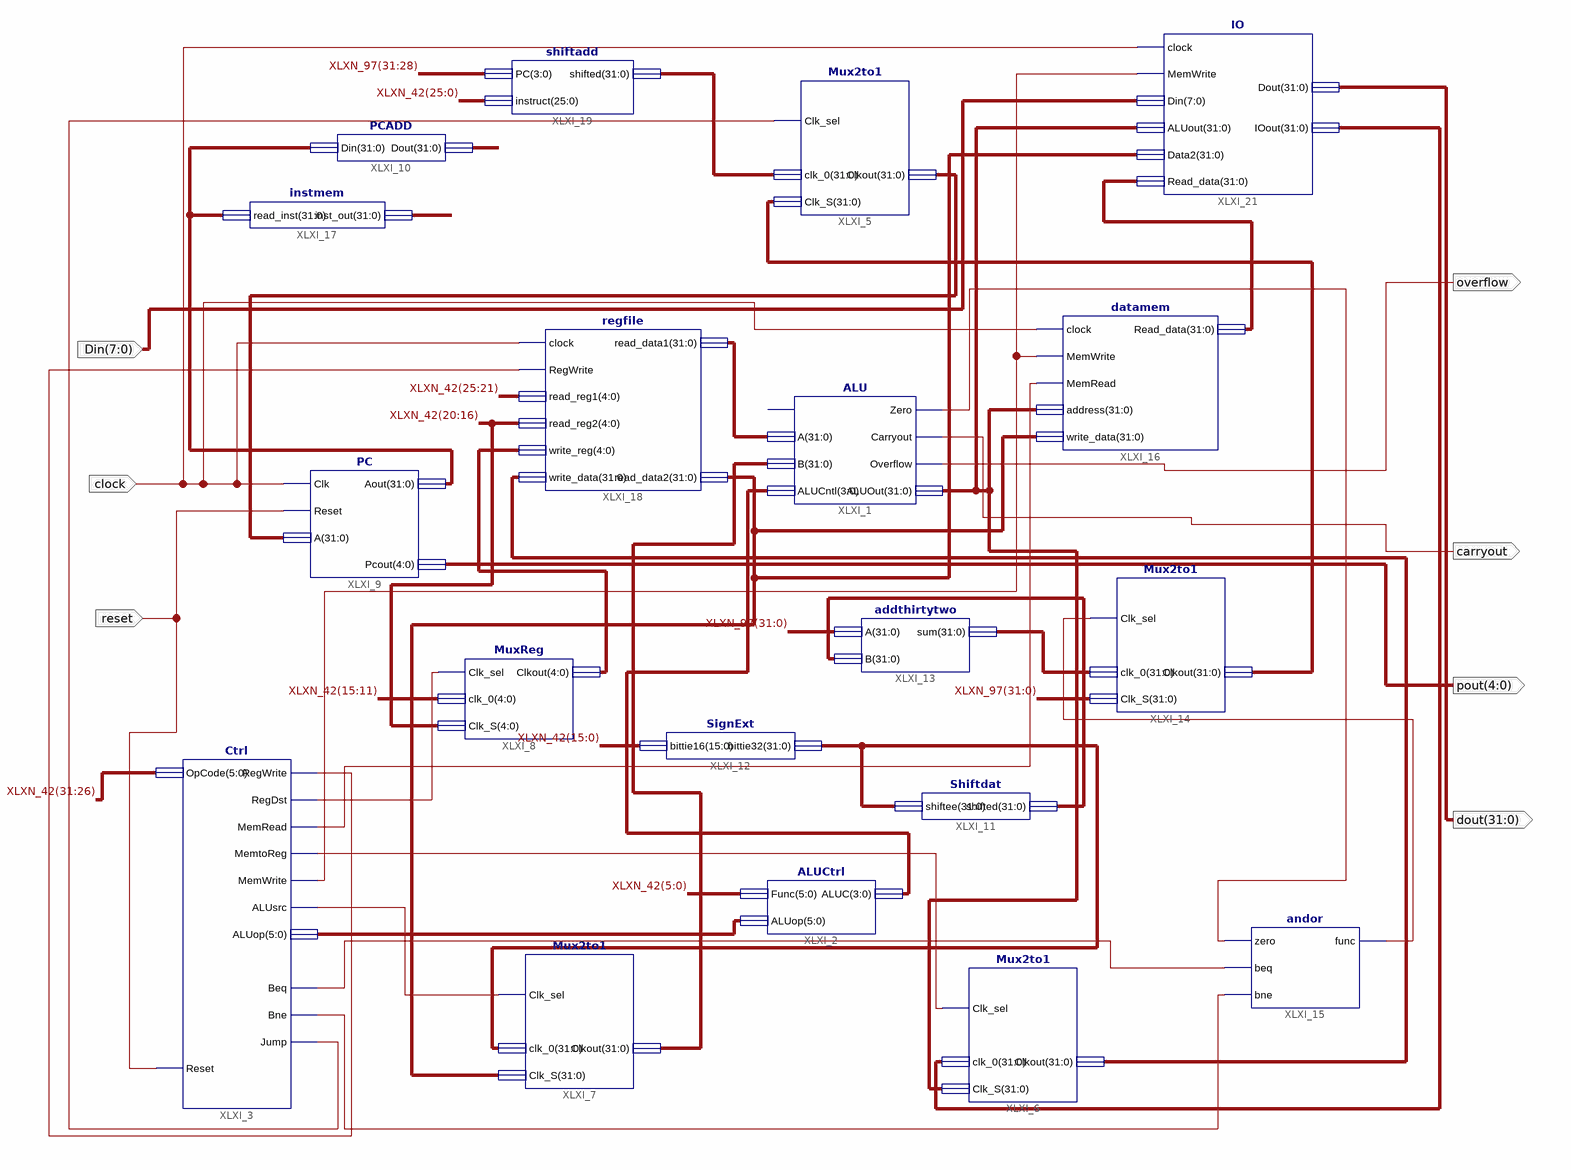
[diagram p0: schematic sheet 1]
// Xilinx ISE schematic datapath.sch (spartan3e) as structural Verilog: 19 symbols, 7 ports
module datapath (
  input  reset,
  input  clock,
  input  [7:0] Din,
  output overflow,
  output carryout,
  output [31:0] dout,
  output [4:0] pout
);

  wire func, XLXN_60, XLXN_61, XLXN_64, XLXN_85, XLXN_88, XLXN_91, XLXN_92, XLXN_118, XLXN_144, XLXN_148;
  wire [3:0] XLXN_123;
  wire [4:0] XLXN_103;
  wire [5:0] XLXN_87;
  wire [31:0] XLXN_42, XLXN_50, XLXN_52, XLXN_53, XLXN_66, XLXN_70, XLXN_71, XLXN_95, XLXN_96, XLXN_97,
       XLXN_100, XLXN_107, XLXN_114, XLXN_115, XLXN_125, XLXN_128;

  Mux2to1 XLXI_5 (.Clk_sel(XLXN_92), .clk_0(XLXN_53), .Clk_S(XLXN_95), .Clkout(XLXN_52));
  instmem XLXI_17 (.read_inst(XLXN_50), .inst_out(XLXN_42));
  PCADD XLXI_10 (.Din(XLXN_50), .Dout(XLXN_97));
  PC XLXI_9 (.Clk(clock), .Reset(reset), .A(XLXN_52), .Aout(XLXN_50), .Pcout(pout));
  shiftadd XLXI_19 (.PC(XLXN_97[31:28]), .instruct(XLXN_42[25:0]), .shifted(XLXN_53));
  regfile XLXI_18 (
    .clock(clock), .RegWrite(XLXN_60), .read_reg1(XLXN_42[25:21]), .read_reg2(XLXN_42[20:16]),
    .write_reg(XLXN_103), .write_data(XLXN_100), .read_data1(XLXN_114), .read_data2(XLXN_71));
  datamem XLXI_16 (
    .clock(clock), .MemWrite(XLXN_118), .MemRead(XLXN_64), .address(XLXN_125), .write_data(XLXN_71),
    .Read_data(XLXN_96));
  andor XLXI_15 (.zero(func), .beq(XLXN_88), .bne(XLXN_91), .func(XLXN_148));
  Mux2to1 XLXI_14 (.Clk_sel(XLXN_148), .clk_0(XLXN_107), .Clk_S(XLXN_97), .Clkout(XLXN_95));
  addthirtytwo XLXI_13 (.A(XLXN_97), .B(XLXN_66), .sum(XLXN_107));
  Mux2to1 XLXI_6 (.Clk_sel(XLXN_85), .clk_0(XLXN_128), .Clk_S(XLXN_125), .Clkout(XLXN_100));
  Shiftdat XLXI_11 (.shiftee(XLXN_70), .shifted(XLXN_66));
  ALUCtrl XLXI_2 (.Func(XLXN_42[5:0]), .ALUC(XLXN_123), .ALUop(XLXN_87));
  Mux2to1 XLXI_7 (.Clk_sel(XLXN_144), .clk_0(XLXN_70), .Clk_S(XLXN_71), .Clkout(XLXN_115));
  ALU XLXI_1 (
    .A(XLXN_114), .B(XLXN_115), .ALUCntl(XLXN_123), .Zero(func), .Carryout(carryout), .Overflow(overflow),
    .ALUOut(XLXN_125));  // open: Carryin
  SignExt XLXI_12 (.bittie16(XLXN_42[15:0]), .bittie32(XLXN_70));
  MuxReg XLXI_8 (.Clk_sel(XLXN_61), .clk_0(XLXN_42[15:11]), .Clk_S(XLXN_42[20:16]), .Clkout(XLXN_103));
  Ctrl XLXI_3 (
    .OpCode(XLXN_42[31:26]), .Jump(XLXN_92), .Beq(XLXN_88), .Bne(XLXN_91), .RegWrite(XLXN_60),
    .RegDst(XLXN_61), .MemRead(XLXN_64), .MemtoReg(XLXN_85), .MemWrite(XLXN_118), .ALUsrc(XLXN_144),
    .ALUop(XLXN_87), .Reset(reset));
  IO XLXI_21 (
    .clock(clock), .MemWrite(XLXN_118), .Din(Din), .ALUout(XLXN_125), .Data2(XLXN_71), .Read_data(XLXN_96),
    .Dout(dout), .IOout(XLXN_128));
endmodule
